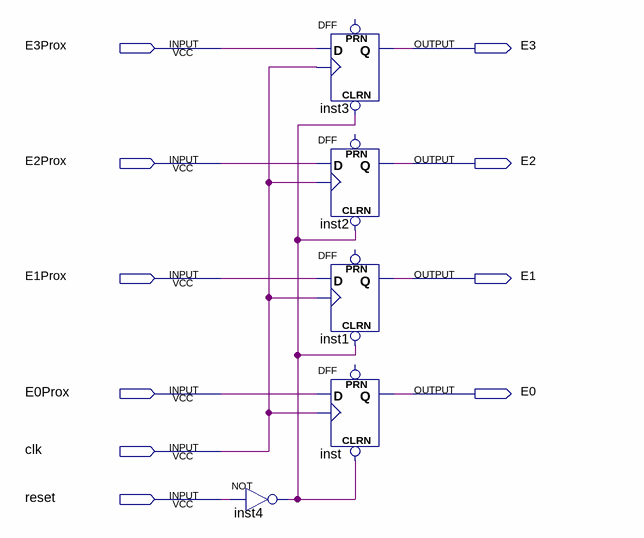
[diagram p0: schematic sheet]
// Quartus schematic Registrador.bdf as structural Verilog: 5 symbols, 10 pins
module Registrador (
  input  E3Prox,
  input  E2Prox,
  input  E1Prox,
  input  E0Prox,
  input  clk,
  input  reset,
  output E3,
  output E2,
  output E1,
  output E0
);

  wire inst4_out;

  not inst4 (inst4_out, reset);
  DFF inst3 (.CLRN(inst4_out), .CLK(clk), .D(E3Prox), .Q(E3));  // open: PRN
  DFF inst2 (.CLRN(inst4_out), .CLK(clk), .D(E2Prox), .Q(E2));  // open: PRN
  DFF inst1 (.CLRN(inst4_out), .CLK(clk), .D(E1Prox), .Q(E1));  // open: PRN
  DFF inst (.CLRN(inst4_out), .CLK(clk), .D(E0Prox), .Q(E0));  // open: PRN
endmodule
